# EAGLE design lightspeakers (EAGLE 6.2)
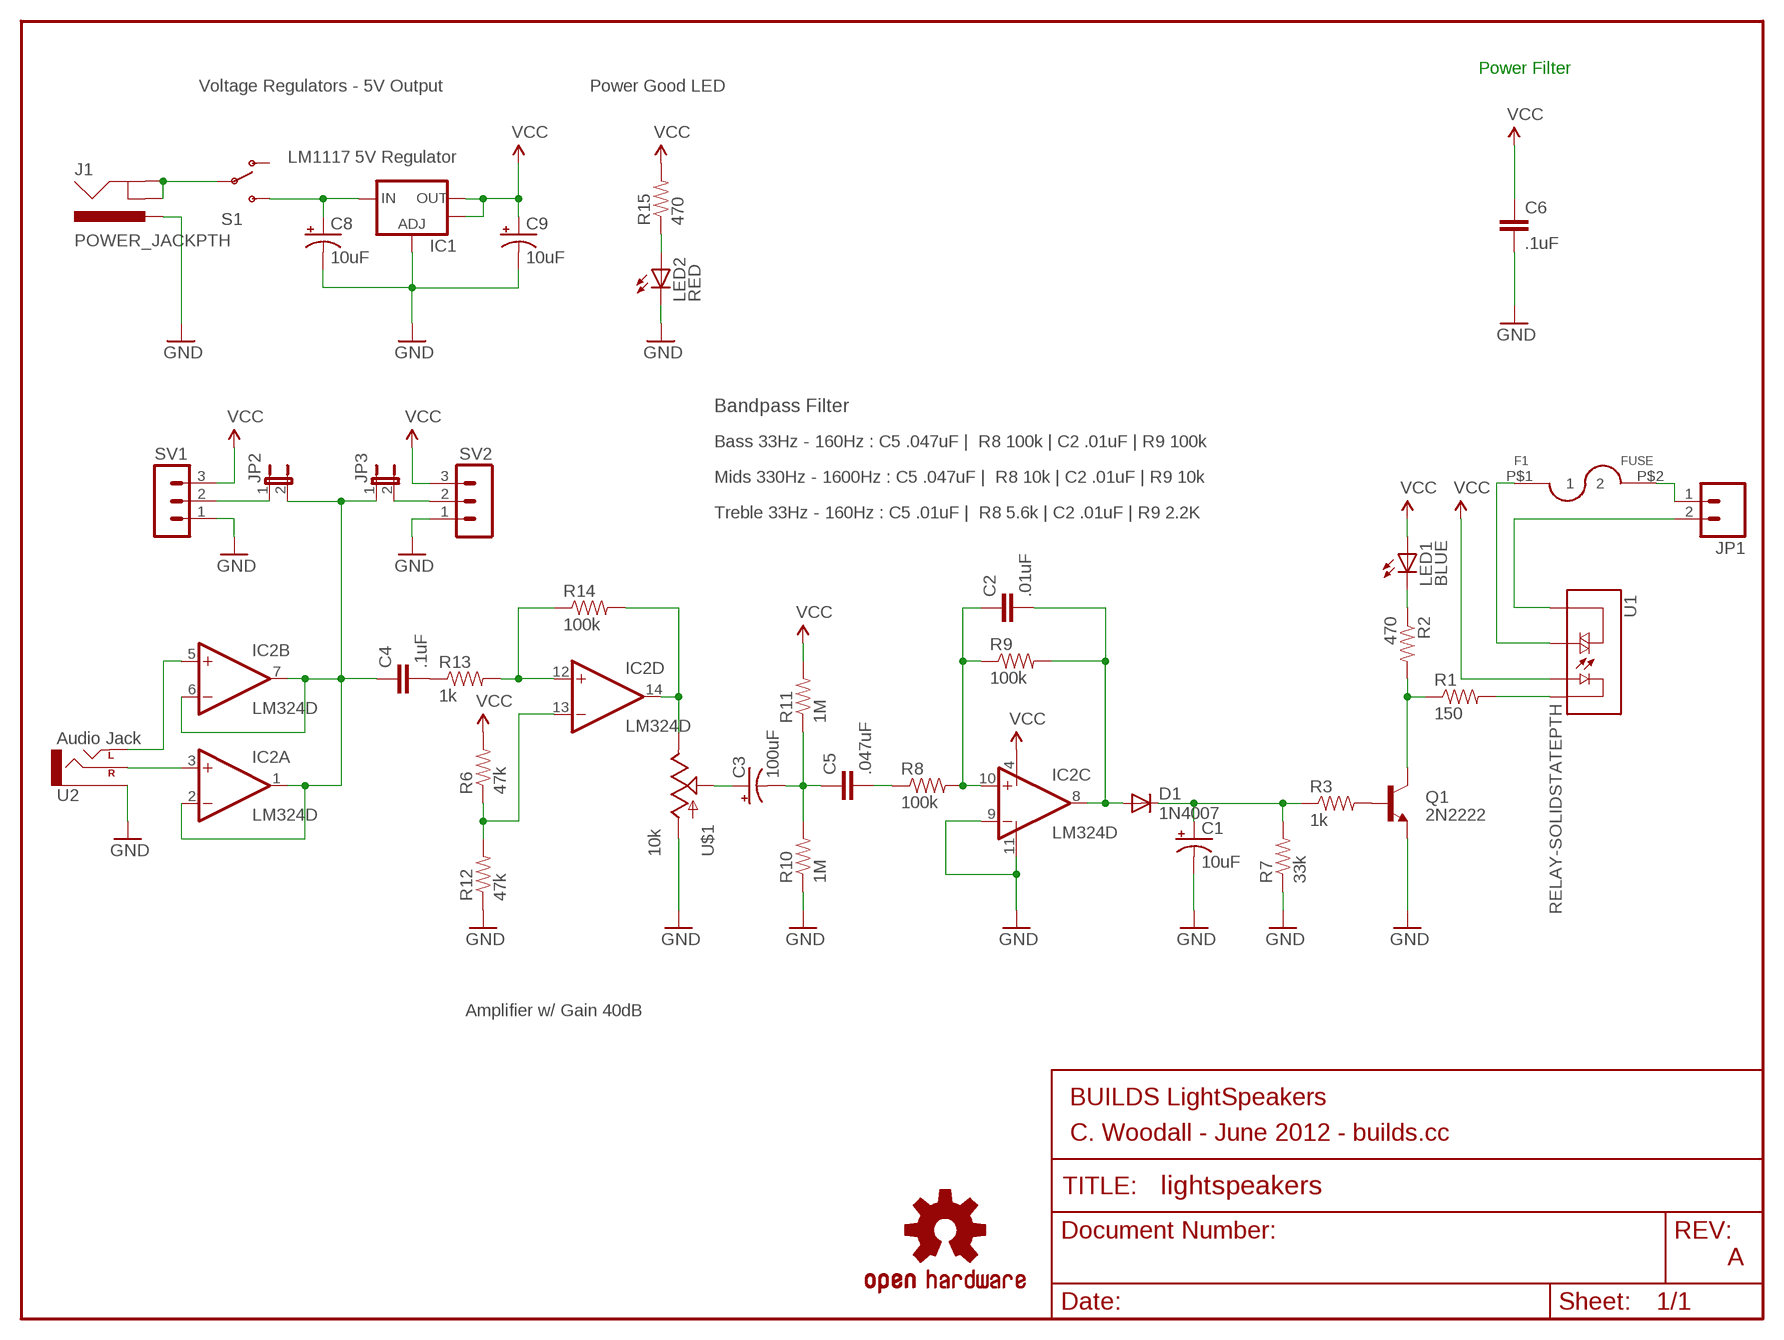
[diagram p0: schematic, sheet 1]

## Parts
C1  10uF  CAP_POLPTH2  [CPOL-RADIAL-10UF-25V]
C2  .01uF  CAP0603-CAP  [0603-CAP]
C3  100uF  CAP_POLPTH1  [CPOL-RADIAL-100UF-25V]
C4  .1uF  CAP0603-CAP  [0603-CAP]
C5  .047uF  CAP0603-CAP  [0603-CAP]
C6  .1uF  CAP0603-CAP  [0603-CAP]
C8  10uF  CAP_POLPTH2  [CPOL-RADIAL-10UF-25V]
C9  10uF  CAP_POLPTH2  [CPOL-RADIAL-10UF-25V]
D1  1N4007  DIODEPTH  [DIODE-1N4001]
F1  FUSE  [20MMX5MMFUSE]
IC1  LM1117 5V Regulator  V_REG_LM1117SOT223  [SOT223]
IC2  LM324D  [SO14]
J1  POWER_JACKPTH  [POWER_JACK_PTH]
JP1  M025MM  [SCREWTERMINAL-5MM-2]
JP2  JUMPER-2PTH  [1X02]
JP3  JUMPER-2PTH  [1X02]
LED1  BLUE  LED0603  [LED-0603]
LED2  RED  LED0603  [LED-0603]
Q1  2N2222  TRANSISTOR_NPNTO-92-AMMO  [TO-92-AMMO]
R1  150  RESISTOR0603-RES  [0603-RES]
R2  470  RESISTOR0603-RES  [0603-RES]
R3  1k  RESISTOR0603-RES  [0603-RES]
R6  47k  RESISTOR0603-RES  [0603-RES]
R7  33k  RESISTOR0603-RES  [0603-RES]
R8  100k  RESISTOR0603-RES  [0603-RES]
R9  100k  RESISTOR0603-RES  [0603-RES]
R10  1M  RESISTOR0603-RES  [0603-RES]
R11  1M  RESISTOR0603-RES  [0603-RES]
R12  47k  RESISTOR0603-RES  [0603-RES]
R13  1k  RESISTOR0603-RES  [0603-RES]
R14  100k  RESISTOR0603-RES  [0603-RES]
R15  470  RESISTOR0603-RES  [0603-RES]
S1  SWITCH-SPSTPTH  [SWITCH-SPDT]
SV1  MA03-1  [MA03-1]
SV2  MA03-1  [MA03-1]
U1  RELAY-SOLIDSTATEPTH  [RELAY-S108T02]
U2  Audio Jack  AUDIO-JACKPTH  [AUDIO-JACK]
U$1  10k  POT100K_3362U  [3362U]
U$2  OSHW-LOGOS  [OSHW-LOGO-S]

## Nets
GND: C1.2(-) C6.2 C8.2(-) C9.2(-) IC1.1(ADJ) IC2.9(C:-IN) IC2.11(P:V-) J1.PWR LED2.C Q1.1(E) R7.1 R10.1 R12.1 SV1.1 SV2.1 U2.SLEEVE U$1.P$3(A)
N$1: Q1.3(C) R1.1 R2.2
N$2: R1.2 U1.4(-)
N$4: F1.P$1 U1.2(T2)
N$5: Q1.2(B) R3.2
N$6: LED1.C R2.1
N$7: C5.2 R8.1
N$8: C1.1(+) D1.C R3.1 R7.2
N$9: C2.2 D1.A IC2.8(C:OUT) R9.2
N$10: C2.1 IC2.10(C:+IN) R8.2 R9.1
N$11: C3.2(-) C5.1 R10.2 R11.1
N$12: C3.1(+) U$1.P$2(S)
N$13: C4.2 R13.1
N$14: JP3.2 SV2.2
N$15: LED2.A R15.1
N$16: J1.GND J1.GNDBREAK S1.2(P)
N$17: IC2.13(D:-IN) R6.1 R12.2
N$18: IC2.14(D:OUT) R14.2 U$1.P$1(E)
N$19: IC2.12(D:+IN) R13.2 R14.1
N$20: JP2.1 SV1.2
N$21: C8.1(+) IC1.3(IN) S1.3(S)
N$22: IC2.5(B:+IN) U2.TIP(LEFT)
N$27: C4.1 IC2.1(A:OUT) IC2.2(A:-IN) IC2.6(B:-IN) IC2.7(B:OUT) JP2.2 JP3.1
N$28: IC2.3(A:+IN) U2.RING(RIGHT)
N$29: JP1.2 U1.1(T1)
N$30: F1.P$2 JP1.1
VCC: C6.1 C9.1(+) IC1.2(OUT) IC1.4(OUT) IC2.4(P:V+) LED1.A R6.2 R11.2 R15.2 SV1.3 SV2.3 U1.3(+)
Unconnected: S1.1(O)

## Notes on the sheet
- Power Filter
- Voltage Regulators - 5V Output | Power Good LED
- Bandpass Filter
- Bass 33Hz - 160Hz : C5 .047uF |  R8 100k | C2 .01uF | R9 100k
- Mids 330Hz - 1600Hz : C5 .047uF |  R8 10k | C2 .01uF | R9 10k
- Treble 33Hz - 160Hz : C5 .01uF |  R8 5.6k | C2 .01uF | R9 2.2K
- Amplifier w/ Gain 40dB
- BUILDS LightSpeakers
- C. Woodall - June 2012 - builds.cc
- A

## Library data of the parts
C1 C3 C8 C9 = SparkFun:CAP_POL: Capacitor Polarized These are standard SMD and PTH capacitors. Normally 10uF, 47uF, and 100uF in electrolytic and tantalum varieties. Always verify the external diameter of the through hole cap, it varies with capacity, voltage, and manufacturer. The EIA devices should be standard.
C2 C4-C6 = SparkFun:CAP: Capacitor Standard 0603 ceramic capacitor, and 0.1" leaded capacitor.
D1 = SparkFun:DIODE: Diode These are standard reverse protection diodes and small signal diodes. SMA package can handle up to about 1A. SOD-323 can handle about 200mA. What the SOD-323 package when ordering, there are some mfgs out there that are 5-pin packages.
F1 = SparkFun:FUSE
IC1 = SparkFun:V_REG_LM1117: Voltage Regulator LM1117 Standard adjustable voltage regulator but in SMD form. Spark Fun Electronics SKU : COM-00595
IC2 = linear:LM324: OP AMP
J1 = SparkFun:POWER_JACK: Power Jack This is the standard 5.5mm barrel jack for power. The PTH is the most common, proven, reliable, footprint. All others are experimental. The Slot footprint only works if the mill layer is transmitted to the PCB fab house so be warned. Spark Fun Electronics SKU : PRT-00119. Mating wall wart : TOL-00298 (and others)
JP1 = SparkFun:M02: Header 2 Standard 2-pin 0.1" header. Use with straight break away headers (SKU : PRT-00116), right angle break away headers (PRT-00553), swiss pins (PRT-00743), machine pins (PRT-00117), and female headers (PRT-00115). Molex polarized connector foot print use with SKU : PRT-08233 with associated crimp pins and housings.
JP2 JP3 = SparkFun:JUMPER-2: Jumper Basic 0.1" spaced jumper. Use with breakaway headers.
LED1 LED2 = SparkFun:LED: LEDs Standard schematic elements and footprints for 5mm, 3mm, 1206, and 0603 sized LEDs. 5mm - Spark Fun Electronics SKU : COM-00529 (and others)
Q1 = SparkFun:TRANSISTOR_NPN: Transistor NPN BJT configuration in SOT23 package. MMBT2222 is the common NPN we use. Double check BCE configuration again layout.
R1-R3 R6-R15 = SparkFun:RESISTOR: Resistor Basic schematic elements and footprints for 0603, 1206, and PTH resistors.
S1 = SparkFun:SWITCH-SPST: SPST Switch Simple slide switch. Spark Fun Electronics SKU : COM-00102
SV1 SV2 = con-lstb:MA03-1: PIN HEADER; OC_FARNELL: unknown; OC_NEWARK: unknown
U1 = SparkFun:RELAY-SOLIDSTATE
U2 = SparkFun:AUDIO-JACK: 3.5mm Audio Jack Simple 3.5mm common PCB mount audio jack. SKU: PRT-08032
U$1 = SparkFun:POT
U$2 = SparkFun:OSHW-LOGO: Open Source Hardware Logo This logo indicates the piece of hardware it is found on incorporates a OSHW license and/or adheres to the definition of open source hardware found here: http://freedomdefined.org/OSHW

## Board
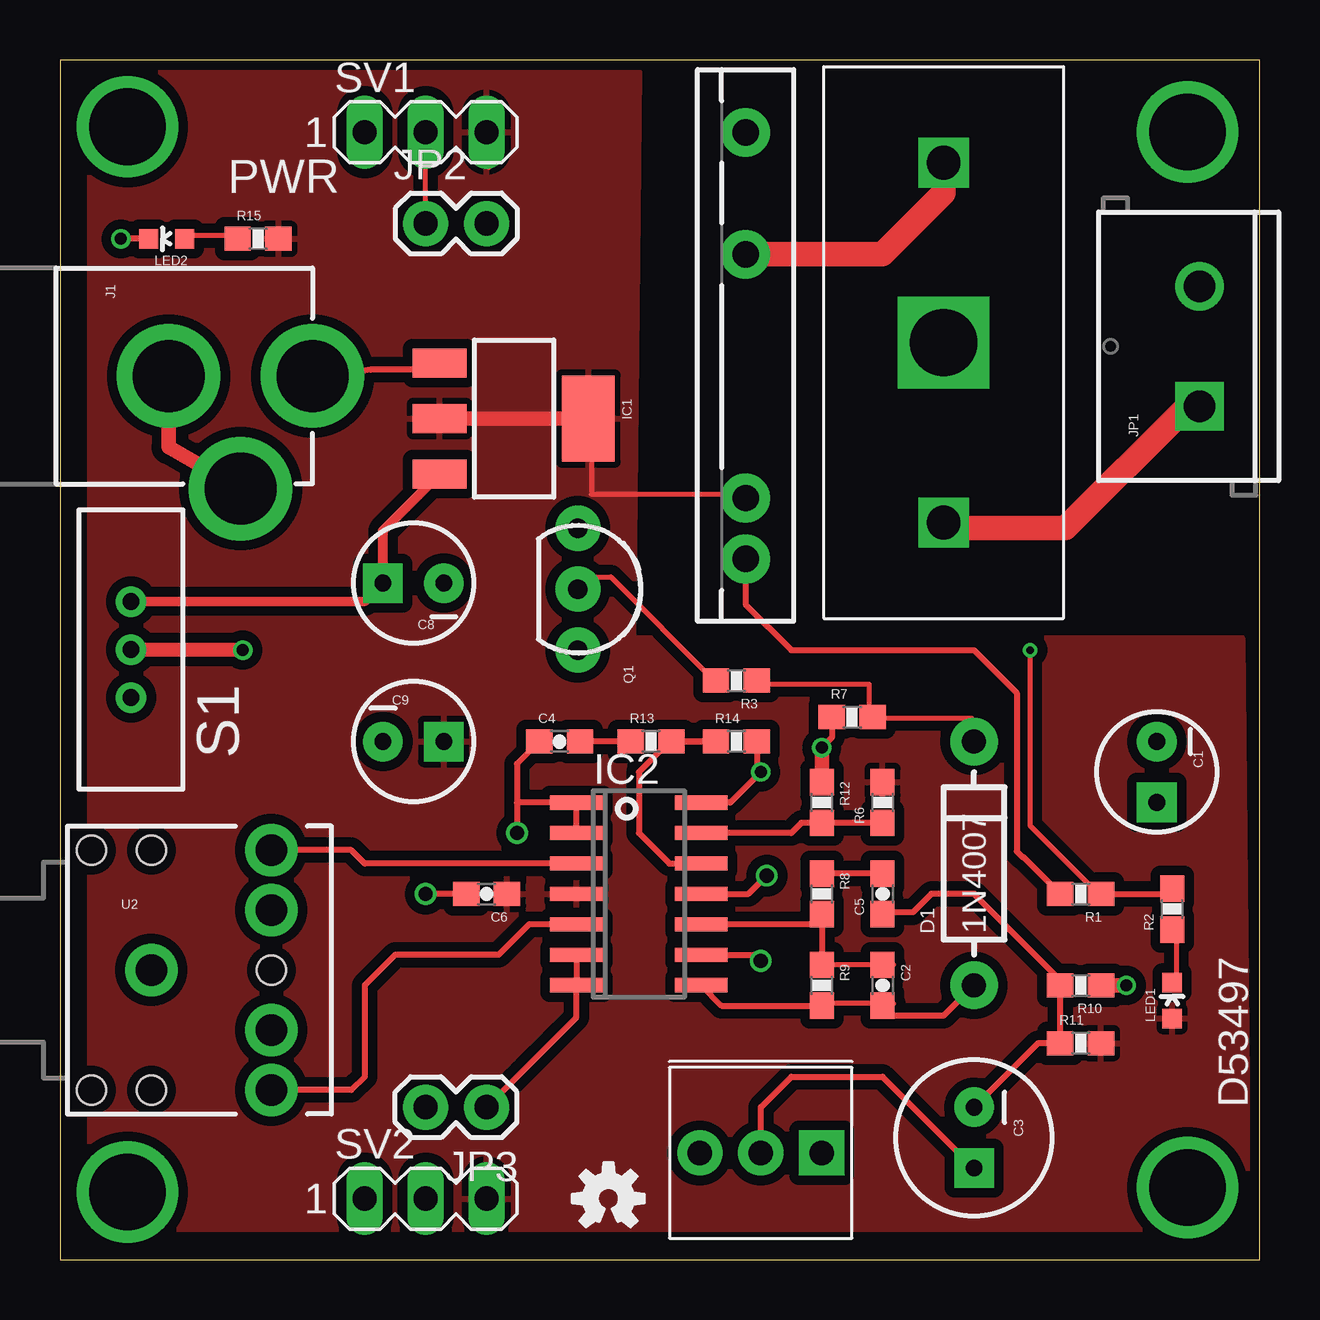
[diagram p1: board, top side]
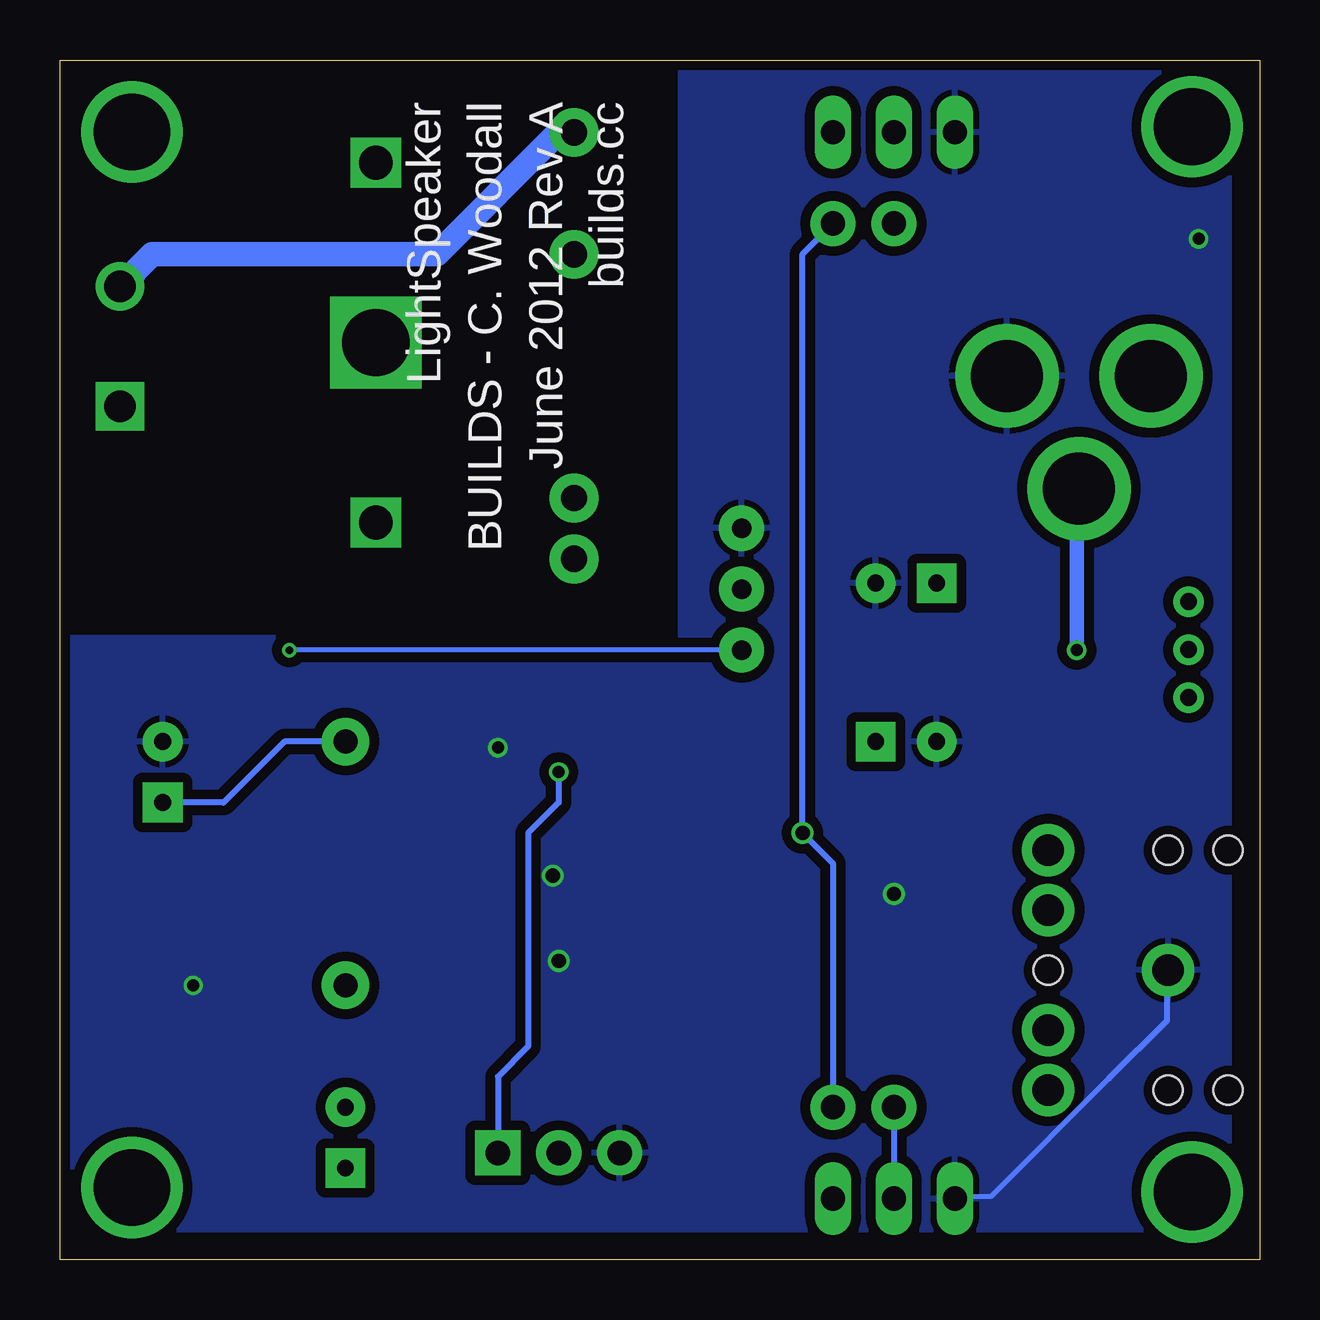
[diagram p2: board, bottom side, seen from below]

Size 50 x 50 mm. Coordinates in mm from the lower left corner, seen from the top.
Outline: 0,0 50,0 50,50 0,50 0,0
Copper layers (1*16): Top 0.035mm / dielectric 1.5mm / Bottom 0.035mm
Design rules: minimum track width 6mil, minimum drill 12mil, track to track 6mil, track to pad 6mil, pad to pad 6mil, via to via 6mil, smd to smd 0mil, copper to edge 10mil, drill to drill 10mil, minimum pad ring 10mil, minimum via ring 6mil, stop-mask expansion 2mil, vias tented up to drill 100mil, thermal gap 10mil

### Footprints (pad centres in the part's own frame; a part is rotated, then mirrored left to right if it is on the bottom)
CPOL-RADIAL-10UF-25V = drill 0.7 pad 1.651 square: 1 1.27,0 | drill 0.7 pad 1.651: 2 -1.27,0
0603-CAP = smd 1.1 x 1: 1 -0.85,0; 2 0.85,0
CPOL-RADIAL-100UF-25V = drill 0.7 pad 1.651 square: 1 1.27,0 | drill 0.7 pad 1.651: 2 -1.27,0
DIODE-1N4001 = drill 1 pad 1.981: A -5.08,0; C 5.08,0
20MMX5MMFUSE = drill 1.4 square: P$1 0,0; P$2 15,0 | drill 2.8 square: P$3 7.5,0
SOT223 = smd 1.219 x 2.235: 1 -2.311,-3.099; 2 0,-3.099; 3 2.311,-3.099 | smd 3.6 x 2.2: 4 0,3.099
SO14 = smd 0.6 x 2.2: 1 -3.81,-2.6; 2 -2.54,-2.6; 3 -1.27,-2.6; 4 0,-2.6; 5 1.27,-2.6; 6 2.54,-2.6; 7 3.81,-2.6; 8 3.81,2.6; 9 2.54,2.6; 10 1.27,2.6; 11 0,2.6; 12 -1.27,2.6; 13 -2.54,2.6; 14 -3.81,2.6
POWER_JACK_PTH = drill 2.997 pad 4.318: GND 0,7.7; GNDBREAK 4.7,10.7; PWR 0,13.7
SCREWTERMINAL-5MM-2 = drill 1.3 pad 2.032 square: 1 0,0 | drill 1.3 pad 2.032: 2 5,0
1X02 = drill 1.016 pad 1.88: 1 0,0; 2 2.54,0
LED-0603 = smd 0.8 x 0.8: A 0,-0.75; C 0,0.75
TO-92-AMMO = drill 0.813 pad 1.88: 1 -2.54,0; 2 0,0; 3 2.54,0
0603-RES = smd 1.1 x 1: 1 -0.85,0; 2 0.85,0
SWITCH-SPDT = drill 0.7 pad 1.27: 1 0,2; 2 0,0; 3 0,-2
MA03-1 = drill 1.016 long: 1 -2.54,0; 2 0,0; 3 2.54,0
RELAY-S108T02 = drill 1.1 pad 2.032: 1 -8.88,0; 2 -3.8,0; 3 6.36,0; 4 8.9,0
AUDIO-JACK = drill 1.3 pad 2.184: RING 5,5; RSH 5,2.5; SLEEVE 0,0; TIP 5,-5; TSH 5,-2.5 | hole 1.2: 0,5; -2.5,5; -2.5,-5; 0,-5; 5,0
3362U = drill 1.016 pad 1.88 square: P$1 0,2.54 | drill 1.016 pad 1.88: P$2 2.54,2.54; P$3 5.08,2.54

### Placement (x,y rotation side)
C1  45.72,20.32 270 top
C2  34.29,11.43 270 top
C3  38.1,5.08 270 top
C4  20.83,21.59 0 top
C5  34.29,15.24 90 top
C6  17.78,15.24 180 top
C8  14.73,28.19 180 top
C9  14.73,21.59 0 top
D1  38.1,16.51 90 top
F1  36.83,45.72 270 top
IC1  18.92,35.05 270 top
IC2  24.13,15.24 270 top
J1  -3.17,36.83 270 top
JP1  47.5,35.56 90 top
JP2  15.24,43.18 0 top
JP3  17.78,6.35 180 top
LED1  46.35,10.79 0 top
LED2  4.45,42.55 90 top
Q1  21.59,27.94 270 top
R1  42.55,15.24 180 top
R2  46.35,14.61 90 top
R3  28.19,24.13 180 top
R6  34.29,19.05 90 top
R7  33.02,22.61 0 top
R8  31.75,15.24 270 top
R9  31.75,11.43 270 top
R10  42.55,11.43 180 top
R11  42.55,9.02 0 top
R12  31.75,19.05 270 top
R13  24.64,21.59 0 top
R14  28.19,21.59 0 top
R15  8.26,42.55 0 top
S1  2.96,25.43 180 top
SV1  15.24,46.99 0 top
SV2  15.24,2.54 0 top
U1  28.57,38.1 270 top
U2  3.81,12.06 0 top
U$1  31.75,6.99 180 top
U$2  22.86,2.54 0 top

### Tracks (layer width: path | path; a pad name or v marks a point on that pad's centre or on a via)
GND  (via drill 0.5, 0.6)
  Top 0.203: 3.86,42.47 LED2.C | 12.8,46.94 SV1.1
  Top 0.254: LED2.C v2.54,42.55 | IC1.1 15.54,37.08 12.95,37.08 11.43,36.83 J1.PWR | C6.2 v15.24,15.24 | IC2.11 28.7,15.24 v29.46,16 | IC2.9 28.96,12.7 v29.21,12.45 | R7.1 32.17,21.76 v31.75,21.34
  Top 0.61: R12.1 v31.75,21.34 | R10.1 v44.45,11.43
  Bottom 0.203: 5.69,8.13 6.27,7.54 11.18,2.64 12.6,2.64 SV2.1 | 45.72,21.54 C1.2 | 31.75,21.18 v31.75,21.34
  Bottom 0.254: 3.86,11.99 3.86,9.96 6.27,7.54
  pour Bottom (isolate 0.406): 1.27,49.53 24.13,49.53 24.13,25.91 49.53,25.91 49.53,1.27 1.27,1.27
N$1  (via drill 0.3)
  Top 0.203: v40.44,25.4 40.44,18.09 43.28,15.24 R1.1
  Top 0.254: R1.1 46.14,15.24 R2.2
  Bottom 0.203: Q1.3 v40.44,25.4
N$2
  Top 0.254: U1.4 28.57,27.3 30.48,25.4 38.1,25.4 39.88,23.62 39.88,17.02 40.13,16.76 40.17,16.76 R1.2
N$4
  Top 1.016: F1.P$1 36.83,44.45 34.29,41.91 28.59,41.91 U1.2
N$5
  Top 0.203: R3.2 27.23,24.18 22.96,28.45 21.74,28.45 21.74,28.04 Q1.2
N$6
  Top 0.203: LED1.C 46.53,11.58 46.53,13.61 R2.1
N$7
  Top 0.254: C5.2 R8.1
N$8
  Top 0.203: R3.1 29.06,23.98 33.73,23.98 33.73,22.76 R7.2 33.93,22.55 38,22.55 38,21.74 D1.C
  Bottom 0.254: D1.C 40.64,21.59 43.18,19.05 C1.1
N$9
  Top 0.203: R9.2 31.9,10.67 34.75,10.67 C2.2
  Top 0.254: IC2.8 27.58,10.58 R9.2 | D1.A 36.83,10.16 34.71,10.16 C2.2
N$10
  Top 0.203: C2.1 34.75,12.29 31.9,12.29 R9.1
  Top 0.254: R9.1 R8.2 31.33,13.97 IC2.10
N$11
  Top 0.254: C3.2 40.77,9.02 R11.1 R10.2 41.7,11.64 38.1,15.24 36.32,15.24 35.56,14.48 34.38,14.48 C5.1
N$12
  Top 0.254: U$1.P$2 29.21,6.35 30.48,7.62 34.29,7.62 C3.1
N$13
  Top 0.254: R13.1 C4.2
N$14
  Bottom 0.254: JP3.2 SV2.2
N$15
  Top 0.203: LED2.A 5.28,42.67 7.32,42.67 R15.1
N$16  (via drill 0.5)
  Top 0.61: J1.GND 4.53,33.86 J1.GNDBREAK | v7.62,25.4 S1.2
  Bottom 0.61: J1.GNDBREAK 7.62,30.86 v7.62,25.4
N$17
  Top 0.203: 31.75,18.14 R12.2
  Top 0.254: R6.1 R12.2 30.9,18.2 30.48,17.78 IC2.13
N$18  (via drill 0.5)
  Top 0.254: R14.2 29.04,20.49 v29.21,20.32 27.94,19.05 IC2.14
  Bottom 0.254: v29.21,20.32 29.21,19.05 30.48,17.78 30.48,8.89 31.75,7.62 U$1.P$1
N$19
  Top 0.254: R13.2 R14.1 25.4,21.59 24.13,20.32 24.13,17.78 25.4,16.51 IC2.12
N$20
  Top 0.203: JP2.1 SV1.2
N$21
  Top 0.406: S1.3 12.72,27.46 C8.1 13.46,30.38 IC1.3
N$22
  Top 0.254: IC2.5 19.56,13.97 18.29,12.7 13.97,12.7 12.7,11.43 12.7,7.62 12.14,7.07 U2.TIP
N$23  (via drill 3.2)
  other vias: 2.81,47.22
N$24  (via drill 3.2)
  other vias: 2.81,2.81
N$25  (via drill 3.2)
  other vias: 47,47
N$26  (via drill 3.2)
  other vias: 47,3
N$27  (via drill 0.6)
  Top 0.254: IC2.2 IC2.1 19.05,19.05 | IC2.6 IC2.7 21.53,10.1 JP3.1 | 19.05,19.05 19.05,20.66 C4.1 | 19.05,19.05 v19.05,17.78
  Bottom 0.254: JP3.1 17.78,16.51 v19.05,17.78 19.05,41.91 JP2.2
N$28
  Top 0.254: IC2.3 12.7,16.51 12.14,17.07 U2.RING
N$29
  Bottom 1.016: U1.1 29.22,46.98 34.29,41.91 46.15,41.91 JP1.2
N$30
  Top 1.016: JP1.1 46.99,35.56 41.91,30.48 37.07,30.48 F1.P$2
VCC
  Top 0.203: 17.88,45.52 17.88,46.94 SV1.3 | U1.3 28.45,31.9 22.15,31.9 22.15,34.95 IC1.4
  Top 0.61: IC1.4 IC1.2
  pour Top (isolate 0.406): 1.27,49.53 24.13,49.53 23.88,25.91 49.28,25.91 49.53,1.27 1.27,1.27

### Text on the board
tNames: PWR | D53497
bNames: builds.cc | June 2012 Rev A | BUILDS - C. Woodall | LightSpeaker